# Altium schematic sheet Line-tracking Sensor.SchDoc
size A4
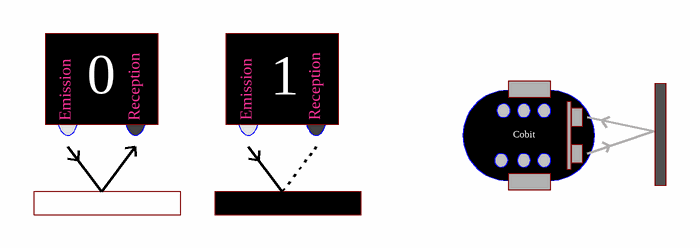
[diagram p0: Line-tracking Sensor.SchDoc]

## Notes on the sheet
- Emission
- 0
- Reception
- 1
- Cobit